# Altium schematic sheet DST800_NMEA2k-CAN_Indicator.SchDoc: TITRE
size Letter; ApprovedBy: Approuvé par; CompanyName: Cégep de Limoilou; DrawnBy: Dessiné par; Organization: Cégep de Limoilou; DocumentNumber: Numéro schéma; Revision: Prel; SheetNumber: 1; SheetTotal: 1; CurrentDate: .date
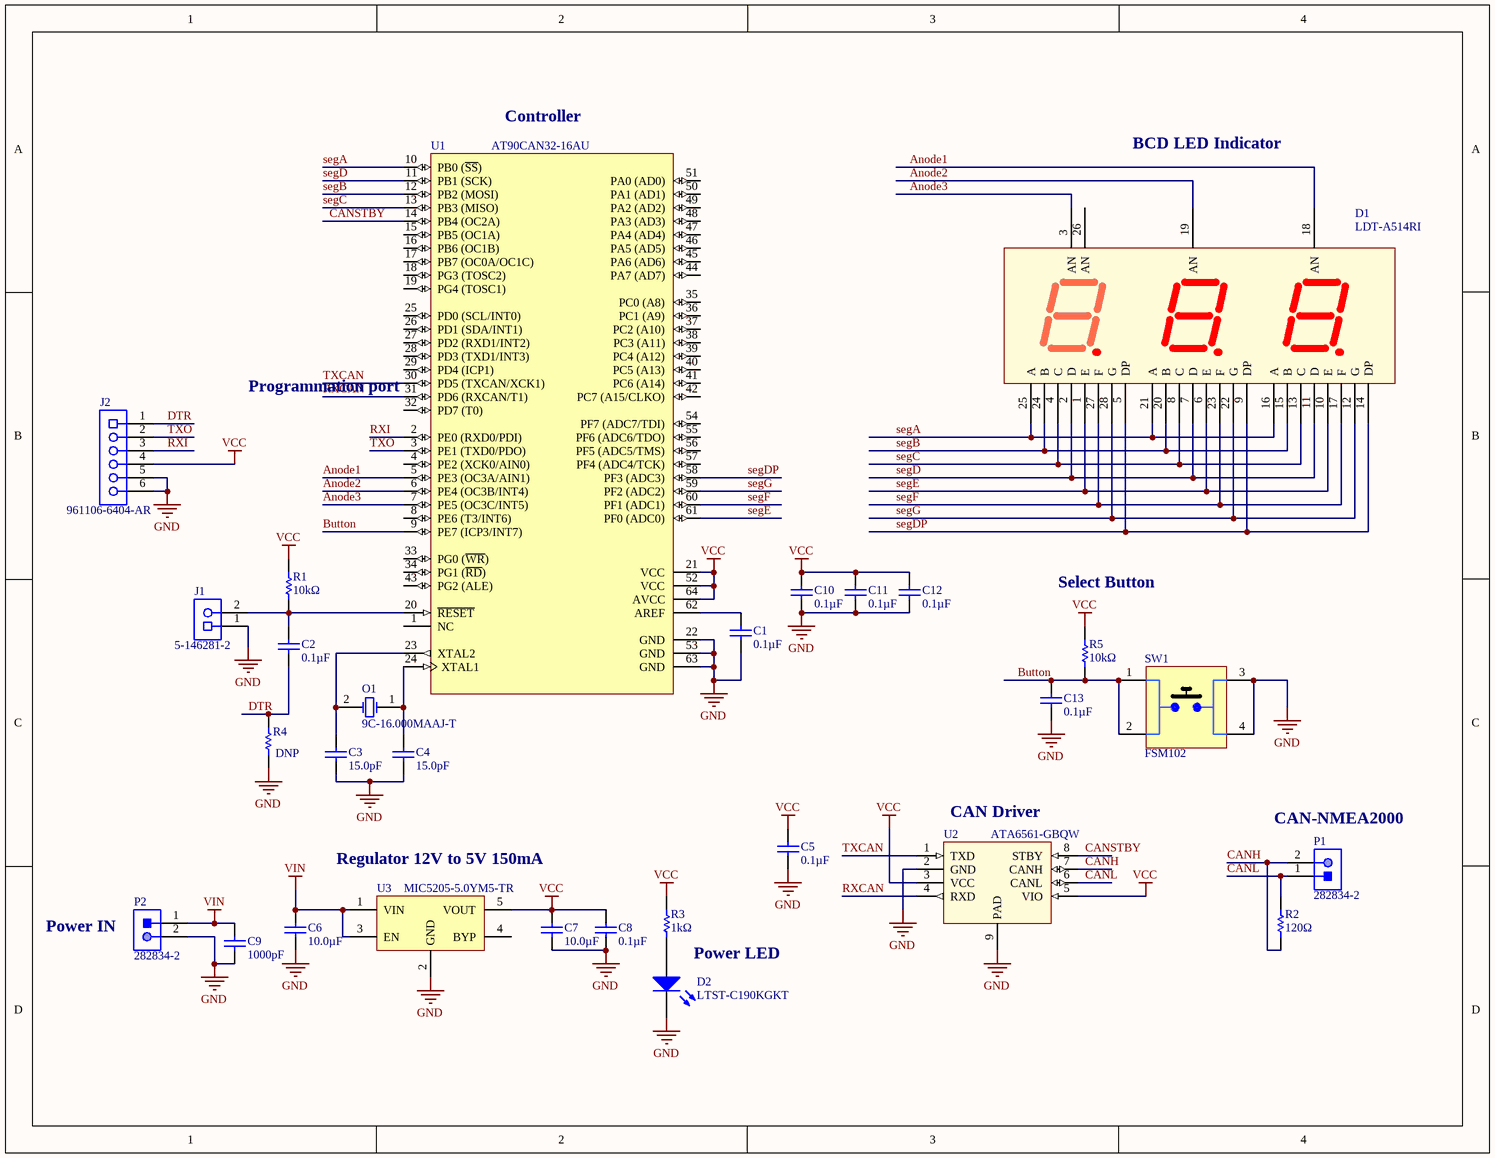
[diagram p0: DST800_NMEA2k-CAN_Indicator.SchDoc]

## Parts
C1  value 0.1µF  [PCB-mhhqftc5ilnrg4qi8ds6-1]  (hidden comment: CL10B104KB8NNNC)
C2  value 0.1µF  [PCB-mhhqftc5ilnrg4qi8ds6-1]  (hidden comment: CL10B104KB8NNNC)
C3  value 15.0pF  [PCB-69ec8bfnjhyebnpbrrfx-1]  (hidden comment: C1608C0G1H150J080AA)
C4  value 15.0pF  [PCB-69ec8bfnjhyebnpbrrfx-1]  (hidden comment: C1608C0G1H150J080AA)
C5  value 0.1µF  [PCB-mhhqftc5ilnrg4qi8ds6-1]  (hidden comment: CL10B104KB8NNNC)
C6  value 10.0µF  [PCB-j0jk5xr8qbnaskonccg4-1]  (hidden comment: C3225X7R1E106K250AC)
C7  value 10.0µF  [PCB-j0jk5xr8qbnaskonccg4-1]  (hidden comment: C3225X7R1E106K250AC)
C8  value 0.1µF  [PCB-mhhqftc5ilnrg4qi8ds6-1]  (hidden comment: CL10B104KB8NNNC)
C9  value 1000pF  [CAPC1608X90X35LL15T15]  (hidden comment: 06031C102MAT2A)
C10  value 0.1µF  [PCB-mhhqftc5ilnrg4qi8ds6-1]  (hidden comment: CL10B104KB8NNNC)
C11  value 0.1µF  [PCB-mhhqftc5ilnrg4qi8ds6-1]  (hidden comment: CL10B104KB8NNNC)
C12  value 0.1µF  [PCB-mhhqftc5ilnrg4qi8ds6-1]  (hidden comment: CL10B104KB8NNNC)
C13  value 0.1µF  [PCB-mhhqftc5ilnrg4qi8ds6-1]  (hidden comment: CL10B104KB8NNNC)
D1  LDT-A514RI  [LDTA514RI]
D2  LTST-C190KGKT  [PCB-eapfwhp0rnksgujf96h3-1]
J1  5-146281-2  [PCB-angfy19quc8nc8nc7d0m-1]
J2  961106-6404-AR  [PCB-660833-1]
O1  9C-16.000MAAJ-T  [PCB-3qvzojcyidn2gltqqmbl-1]
P1  282834-2  [PCB-0kdx5sneyudsmu18l6zv-1]
P2  282834-2  [PCB-0kdx5sneyudsmu18l6zv-1]
R1  value 10kΩ  [RESC1608X55X30NL15T15]  (hidden comment: CRG0603F10K)
R2  value 120Ω  [RESC3216X60X45LL10T20]  (hidden comment: CRCW1206120RJNEA)
R3  value 1kΩ  [RESC1608X55X30NL20T20]  (hidden comment: ERA-3YEB102V)
R4  DNP  [RESC1608X55X30NL20T20]  (no BOM)
R5  value 10kΩ  [RESC1608X55X30NL15T15]  (hidden comment: CRG0603F10K)
SW1  FSM102  [PCB-8ps4wla3pj92cxv2yuvu-1]
U1  AT90CAN32-16AU  [64A_L]
U2  ATA6561-GBQW  [PCB_8-PinVDFN]
U3  MIC5205-5.0YM5-TR  [SOT-23-5_N]

## Nets
GND: C1.1 C3.1 C4.1 C5.1 C6.1 C7.1 C8.1 C9.1 C10.1 C11.1 C12.1 C13.1 D2.2(K) J1.1 J2.5 J2.6 P2.2 R4.1 SW1.3 SW1.4 U1.22(GND) U1.53(GND) U1.63(GND) U2.2(GND) U2.9(PAD) U3.2(GND)
VCC: C5.2 C7.2 C8.2 C10.2 C11.2 C12.2 J2.4 R1.2 R3.2 R5.2 U1.21(VCC) U1.52(VCC) U1.64(AVCC) U2.3(VCC) U2.5(VIO) U3.5(VOUT)
VIN: C6.2 C9.2 P2.1 U3.1(VIN) U3.3(EN)
Anode1: D1.18(AN) U1.5(PE3_(OC3A/AIN1))
Anode2: D1.19(AN) U1.6(PE4_(OC3B/INT4))
Anode3: D1.3(AN) U1.7(PE5_(OC3C/INT5))
Button: C13.2 R5.1 SW1.1 SW1.2 U1.9(PE7_(ICP3/INT7))
CANH: P1.2 R2.1 U2.7(CANH)
CANL: P1.1 R2.2 U2.6(CANL)
CANSTBY: U1.14(PB4_(OC2A)) U2.8(STBY)
DTR: C2.1 J2.1 R4.2
RXCAN: U1.31(PD6_(RXCAN/T1)) U2.4(RXD)
RXI: J2.3 U1.2(PE0_(RXD0/PDI))
segA: D1.16(A) D1.21(A) D1.25(A) U1.10(PB0_(~{SS}))
segB: D1.15(B) D1.20(B) D1.24(B) U1.12(PB2_(MOSI))
segC: D1.4(C) D1.8(C) D1.13(C) U1.13(PB3_(MISO))
segD: D1.2(D) D1.7(D) D1.11(D) U1.11(PB1_(SCK))
segDP: D1.5(DP) D1.9(DP) D1.14(DP) U1.58(PF3_(ADC3))
segE: D1.1(E) D1.6(E) D1.10(E) U1.61(PF0_(ADC0))
segF: D1.17(F) D1.23(F) D1.27(F) U1.60(PF1_(ADC1))
segG: D1.12(G) D1.22(G) D1.28(G) U1.59(PF2_(ADC2))
TXCAN: U1.30(PD5_(TXCAN/XCK1)) U2.1(TXD)
TXO: J2.2 U1.3(PE1_(TXD0/PDO))
NetC1_2: C1.2 U1.62(AREF)
NetC2_2: C2.2 J1.2 R1.1 U1.20(~{RESET})
NetC3_2: C3.2 O1.2(X2) U1.23(XTAL2)
NetC4_2: C4.2 O1.1(X1) U1.24(XTAL1)
NetD2_1: D2.1(A) R3.1

Not connected (* = marked no-connect by the designer): D1 26(AN); U1 1(NC) 4(PE2_(XCK0/AIN0)) 8(PE6_(T3/INT6)) 15(PB5_(OC1A)) 16(PB6_(OC1B)) 17(PB7_(OC0A/OC1C)) 18(PG3_(TOSC2)) 19(PG4_(TOSC1)) 25(PD0_(SCL/INT0)) 26(PD1_(SDA/INT1)) 27(PD2_(RXD1/INT2)) 28(PD3_(TXD1/INT3)) 29(PD4_(ICP1)) 32(PD7_(T0)) 33(PG0_(~{WR})) 34(PG1_(~{RD})) 35(PC0_(A8)) 36(PC1_(A9)) 37(PC2_(A10)) 38(PC3_(A11)) 39(PC4_(A12)) 40(PC5_(A13)) 41(PC6_(A14)) 42(PC7_(A15/CLKO)) 43(PG2_(ALE)) 44(PA7_(AD7)) 45(PA6_(AD6)) 46(PA5_(AD5)) 47(PA4_(AD4)) 48(PA3_(AD3)) 49(PA2_(AD2)) 50(PA1_(AD1)) 51(PA0_(AD0)) 54(PF7_(ADC7/TDI)) 55(PF6_(ADC6/TDO)) 56(PF5_(ADC5/TMS)) 57(PF4_(ADC4/TCK)); U3 4(BYP)

## Notes on the sheet
- (near U1) Controller
- BCD LED Indicator
- (near J2) Programmation port
- (near R5) Select Button
- (near U2) CAN Driver
- (near P1) CAN-NMEA2000
- Regulator 12V to 5V 150mA
- (near P2) Power IN
- Power LED

## Library data of the parts
C1 C2 C5 C8 C10-C13 = CMP-1af8d38ac64bc53f-5: CAP CER 0.1uF 50V X7R 0603; Manufacturer: Samsung Electro-Mechanics; Octopart URL: https://octopart.com/cl10b104kb8nnnc-samsung-7928277; OctopartID: 1af8d38ac64bc53f; Mounting Type: SMT; ManufacturerPartNumber: CL10B104KB8NNNC; Type: X7R; Supplier 1: Digi-Key; Supplier Part Number 1: 1276-1000-1-ND
C3 C4 = CMP-57259fa49f8088e2-2: CAP CER 15pF ±5% 50V C0G/NP0 0603 [1608]; Manufacturer: TDK; Octopart URL: https://octopart.com/c1608c0g1h150j080aa-tdk-25947587; OctopartID: 57259fa49f8088e2; ManufacturerPartNumber: C1608C0G1H150J080AA; Type: C0G/NP0; Mounting Type: SMT; Supplier 1: Digi-Key; Supplier Part Number 1: 445-1271-1-ND
C6 C7 = CMP-2bdce35de069f41b-1: CAP CER 10uF ±10% 25V X7R 1210; Manufacturer: TDK; Case/Package: 1210; OctopartID: 2bdce35de069f41b; Octopart URL: http://octopart.com/c3225x7r1e106k250ac-tdk-25947859; ManufacturerPartNumber: C3225X7R1E106K250AC; Mounting Type: SMT; Type: X7R; Supplier 1: Digi-Key; Supplier Part Number 1: 445-3942-1-ND
C9 = CMP-126202-2: CAP CER 1000pF ±20% 100V X7R 0603; Manufacturer: AVX; Case/Package: 0603; Octopart Url: https://octopart.com/06031c102mat2a-avx+interconnect+%2F+elco-195738; OctopartID: 2b04e20cf2f8f4c3; ManufacturerPartNumber: 06031C102MAT2A; Tolerance: ±20%; Type: X7R; Mounting Type: SMT; Supplier 1: Digi-Key; Supplier Part Number 1: 478-3699-1-ND
D1 = CMP-6dbba4b18441b27c-1: Display 3-digit 7-Seg 0.56 in; Manufacturer: Lumex; Octopart URL: http://octopart.com/ldt-a514ri-lumex-52380; Case/Package: DIP; OctopartID: 6dbba4b18441b27c; ManufacturerPartNumber: LDT-A514RI; Mounting Type: TH; Supplier 1: Digi-Key; Supplier Part Number 1: 67-1423-ND
D2 = CMP-e1642866a00b3ea3-3: LED 0603 green; Manufacturer: Lite-On; Octopart URL: http://octopart.com/ltst-c190kgkt-lite-on-549897; OctopartID: e1642866a00b3ea3; Case/Package: 0603; ManufacturerPartNumber: LTST-C190KGKT; Mounting Type: SMT; Supplier 1: Digi-Key; Supplier Part Number 1: 160-1435-1-ND
J1 = CMP-39c9f206a0b6e60e-14: CONN HEADER VERT 2POS Single 0.1in pitch; Manufacturer: TE Connectivity; OctopartID: 39c9f206a0b6e60e; ManufacturerPartNumber: 5-146281-2; Mounting Type: TH; Supplier 1: Digi-Key; Supplier Part Number 1: A121481-ND
J2 = CMP-660833-2: CONN HEADER VERT 6POS Single 0.1in pitch; Manufacturer: 3M; Octopart Url: https://octopart.com/961106-6404-ar-3m-14400736; OctopartID: f2bb3b6a6b3d2d7c; ManufacturerPartNumber: 961106-6404-AR; Mounting Type: TH; Supplier 1: Digi-Key; Supplier Part Number 1: 3M9457-06-ND
O1 = CMP-df271731c43900e0-3: Crystal 16MHz 30ppm  18pF  HC-49/S SMD; Manufacturer: TXC CORPORATION; OctopartID: df271731c43900e0; Octopart URL: http://octopart.com/9c-16.000maaj-t-txc-18628216; ManufacturerPartNumber: 9C-16.000MAAJ-T; Mounting Type: SMT; Supplier 1: Digi-Key; Supplier Part Number 1: 887-1059-1-ND
P1 P2 = CMP-369bfdc835bbe95c-32: CONN Terminal Block; 16-30 AWG 0.197 in; Manufacturer: TE Connectivity; Octopart URL: https://octopart.com/282836-2-te+connectivity-39396934; ManufacturerPartNumber: 282834-2; Mounting Type: TH; Supplier 1: Digi-Key; Supplier Part Number 1: A98333-ND
R1 R5 = CMP-584891b72cc4878f-2: RES 10K 1% 0.1W 0603; Manufacturer: TE Connectivity; Case/Package: 0603; Octopart URL: http://octopart.com/crg0603f10k-te+connectivity-16077290; OctopartID: 584891b72cc4878f; Power Rating: 0.1 W; ManufacturerPartNumber: CRG0603F10K; Mounting Type: SMT; Supplier 1: Digi-Key; Supplier Part Number 1: A106048CT-ND
R2 = CMP-1858100-4: RES Thick Film 120ohm 5% 1/4W 1206; Manufacturer: Vishay; Power Rating: 0.25 W; Octopart Url: https://octopart.com/crcw1206120rjnea-vishay+dale-39437323; Case/Package: 1206[3216]; OctopartID: 57d69c85b6bb8811; ManufacturerPartNumber: CRCW1206120RJNEA; Mounting Type: SMT; Tolerance: ±5%; Type: Thick; Supplier 1: Digi-Key; Supplier Part Number 1: 541-120ECT-ND
R3 = CMP-3717598-2: RES Metal Film 1Kohm 0.1%  0603; Manufacturer: Panasonic; Power Rating: 0.063 W; Octopart Url: https://octopart.com/era-3yeb102v-panasonic-55477313; OctopartID: 4ba281e6ea859465; ManufacturerPartNumber: ERA-3YEB102V; Mounting Type: SMT; Tolerance: ±0.1%; Type: Metal; Supplier 1: Digi-Key; Supplier Part Number 1: P1.0KYCT-ND
R4 = CMP-3717598-2: RES Metal Film 1Kohm 0.1%  0603; ManufacturerPartNumber: ERA-3YEB102V; Manufacturer: Panasonic; Power Rating: 0.063 W; Value: 1kΩ; Octopart Url: https://octopart.com/era-3yeb102v-panasonic-55477313; OctopartID: 4ba281e6ea859465; Mounting Type: SMT; Tolerance: ±0.1%; Type: Metal; Supplier 1: Digi-Key; Supplier Part Number 1: P1.0KYCT-ND
SW1 = CMP-43e488b0e8c29c23-11: PUSHBUTTON Momentary Tactile SPST Thru-Hole; Manufacturer: TE Connectivity; OctopartID: 43e488b0e8c29c23; ManufacturerPartNumber: FSM102; Mounting Type: TH; Supplier 1: Digi-Key; Supplier Part Number 1: 450-1128-ND
U1 = CMP-972593-3: IC Microcontroller 8-bit AVR 32KB Flash CAN Controller 53GPIO 64-pin LQFP; Manufacturer: Microchip; Case/Package: TQFP; Octopart Url: https://octopart.com/at90can32-16au-atmel-39961781; OctopartID: ffbd34d61e6e207a; ManufacturerPartNumber: AT90CAN32-16AU; Mounting Type: SMT; Supplier 1: Digi-Key; Supplier Part Number 1: AT90CAN32-16AU-ND
U2 = CMP-9a565056add04591-7: IC Transeiver CAN 5Mbps 8-Pin VDFN EP; Manufacturer: Microchip; OctopartID: 9a565056add04591; Octopart URL: http://octopart.com/ata6561-gbqw-atmel-50991840; ManufacturerPartNumber: ATA6561-GBQW; Mounting Type: SMT; Supplier 1: Digi-Key; Supplier Part Number 1: ATA6561-GBQWCT-ND
U3 = CMP-6255a8a416e5bd92-5: IC Regulator LDO 5 V Fixed Output 150 mA SOT-23-5; Manufacturer: Microchip; Octopart URL: https://octopart.com/mic5205-5.0ym5-tr-microchip-66802134; ManufacturerPartNumber: MIC5205-5.0YM5-TR; Mounting Type: SMT; Supplier 1: Digi-Key; Supplier Part Number 1: 576-1261-1-ND